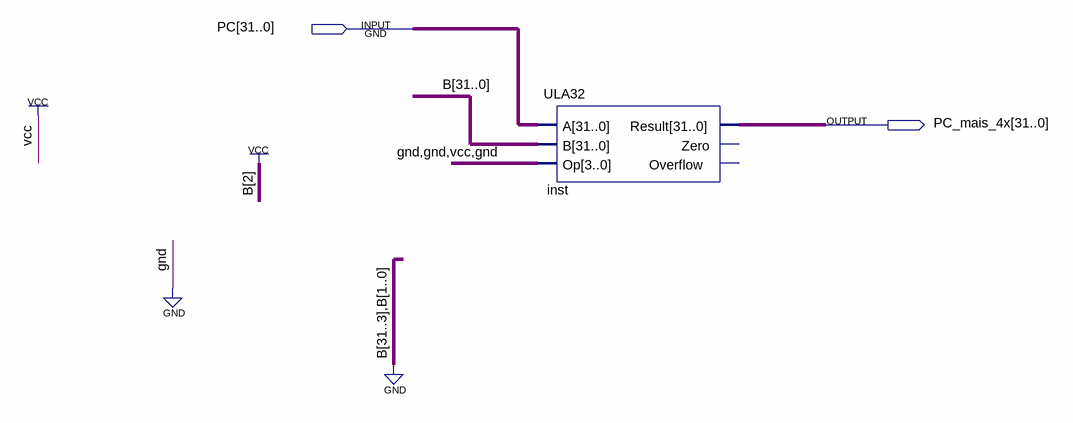
[diagram p0: schematic sheet]
// Quartus schematic PC_Soma_4x.bdf as structural Verilog: 1 symbols, 2 pins
module PC_Soma_4x (
  input  [31:0] PC,
  output [31:0] PC_mais_4x
);

  ULA32 inst (
    .A(PC), .B(32'b00000000000000000000000000000100), .Op(4'b0010), .Result(PC_mais_4x));  // open: Zero, Overflow
endmodule
